# Altium project IntegratedShelfControl.PrjPCB (part 2 of 2)

## Sheet HighCurrentFetGND.SchDoc
size A4
Used 10 times, as channels HCFetG, HCFetG, HCFetG, HCFetG, HCFetG, HCFetG, HCFetG, HCFetG, HCFetG, HCFetG. Parts and nets are listed once, with the designators drawn on the sheet.
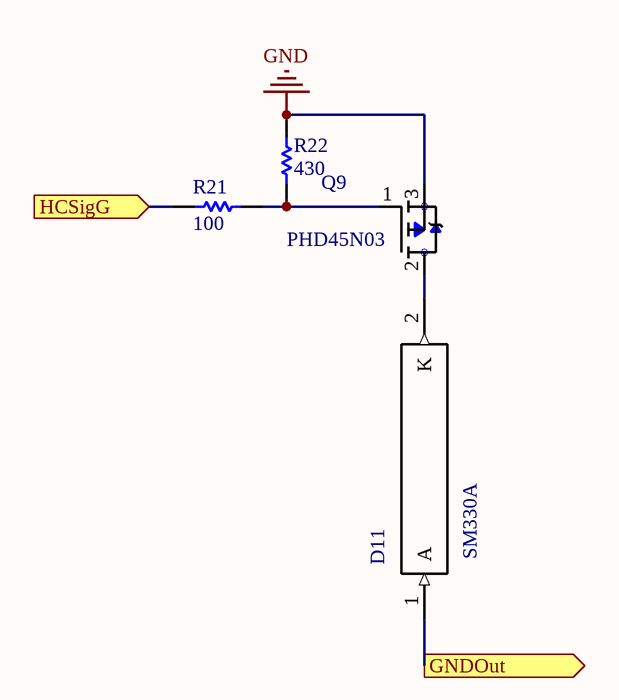
[diagram p9: HighCurrentFetGND.SchDoc]

### Parts
D11  SM330A  [*DIOM5227X270N_S1M(Primary)]
Q9  PHD45N03  [*DPAK228P998X235-3N]
R21  value 100  [6-0805_L]  (hidden comment: R100)
R22  value 430  [6-0805_L]  (hidden comment: R430)

### Ports
GNDOut (out), HCSigG (in)

### Nets
GND: Q9.3(S) R22.1
GNDOut: D11.1(A) ; port GNDOut
HCSigG: R21.1 ; port HCSigG
NetD11_2: D11.2(K) Q9.2(D)
NetQ9_1: Q9.1(G) R21.2 R22.2

### Channels
HCFetG: designators end in _HCFetG10; ports GNDOut=GNDY1 HCSigG=NetR21_HCFetG10_1
HCFetG: designators end in _HCFetG9; ports GNDOut=GNDY2 HCSigG=NetR21_HCFetG9_1
HCFetG: designators end in _HCFetG8; ports GNDOut=GNDY3 HCSigG=NetR21_HCFetG8_1
HCFetG: designators end in _HCFetG7; ports GNDOut=GNDY4 HCSigG=NetR21_HCFetG7_1
HCFetG: designators end in _HCFetG6; ports GNDOut=GNDY5 HCSigG=NetR21_HCFetG6_1
HCFetG: designators end in _HCFetG5; ports GNDOut=GNDYL1 HCSigG=NetR21_HCFetG5_1
HCFetG: designators end in _HCFetG4; ports GNDOut=GNDYL2 HCSigG=NetR21_HCFetG4_1
HCFetG: designators end in _HCFetG3; ports GNDOut=GNDYL3 HCSigG=NetR21_HCFetG3_1
HCFetG: designators end in _HCFetG2; ports GNDOut=GNDYL4 HCSigG=NetR21_HCFetG2_1
HCFetG: designators end in _HCFetG1; ports GNDOut=GNDYL5 HCSigG=NetR21_HCFetG1_1

### Notes on the sheet
- Title
- Size:
- Date:
- A4
- Number:
- Time:
- Revision:
- Sheet
- of
- File:

### Library data of the parts
D11 = STPS2L60A: SCHOTTKY RECTIFIER 2A; Voltage Vrrm: 60V; Diode Case Style: DO-214AC; Case Style: DO-214AC; pin to pad: 1>A 2>A; MF: STMicroelectronics; Price: None; Availability: Unavailable; SnapEDA_Link: https://www.snapeda.com/parts/STPS2L60A/STMicroelectronics/view-part/?ref=snap; Package: DO-214 STMicroelectronics; MP: STPS2L60A; Value: *
Q9 = IPD50P04P4L-11: P-Channel 40 V 10.6 mOhm OptiMOSآ®-P2 Power-Transistor -PG-TO-252-3; MF: Infineon Technologies; MP: IPD50P04P4L-11; Package: TO-252-3 Infineon; Price: None; Availability: Unavailable; SnapEDA_Link: https://www.snapeda.com/parts/IPD50P04P4L-11/Infineon%20Technologies/view-part/?ref=snap; Value: *
R21 R22 = Res1: Resistor; Published: 8-Jun-2000; LatestRevisionDate: 17-Jul-2002; LatestRevisionNote: Re-released for DXP Platform.; PackageReference: AXIAL-0.3; Publisher: Altium Limited; PackageDescription: Axial Device, Thru-Hole; 2 Leads; 0.3 in Pin Spacing

## Sheet SensorIn.SchDoc
size A4
Used 10 times, as channels SenIn, SenIn, SenIn, SenIn, SenIn, SenIn, SenIn, SenIn, SenIn, SenIn. Parts and nets are listed once, with the designators drawn on the sheet.
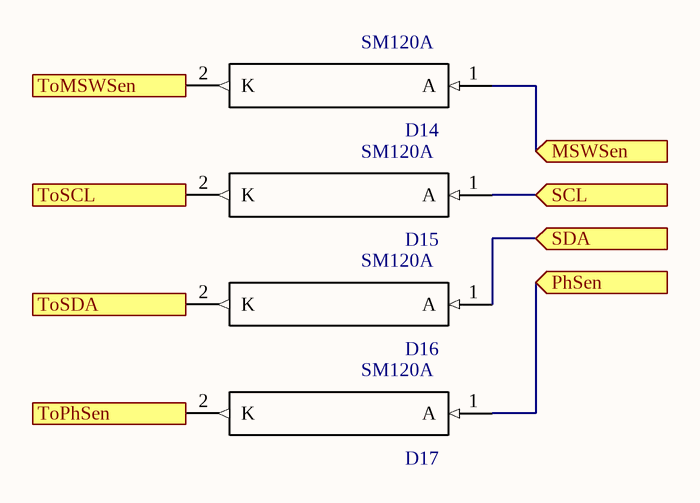
[diagram p10: SensorIn.SchDoc]

### Parts
D14  SM120A  [*DIOM5227X270N_S1M(Primary)]
D15  SM120A  [*DIOM5227X270N_S1M(Primary)]
D16  SM120A  [*DIOM5227X270N_S1M(Primary)]
D17  SM120A  [*DIOM5227X270N_S1M(Primary)]

### Ports
MSWSen (in), PhSen (in), SCL (in), SDA (in), ToMSWSen (out), ToPhSen (out), ToSCL (out), ToSDA (out)

### Nets
MSWSen: D14.1(A) ; port MSWSen
PhSen: D17.1(A) ; port PhSen
SCL: D15.1(A) ; port SCL
SDA: D16.1(A) ; port SDA
ToMSWSen: D14.2(K) ; port ToMSWSen
ToPhSen: D17.2(K) ; port ToPhSen
ToSCL: D15.2(K) ; port ToSCL
ToSDA: D16.2(K) ; port ToSDA

### Channels
SenIn: designators end in _SenIn10; ports MSWSen=MSWSen1 PhSen=PhSen1 SCL=SCL1 SDA=SDA1 ToMSWSen=MSWSen ToPhSen=PhSen ToSCL=SCL ToSDA=SDA
SenIn: designators end in _SenIn9; ports MSWSen=MSWSen2 PhSen=PhSen2 SCL=SCL2 SDA=SDA2 ToMSWSen=MSWSen ToPhSen=PhSen ToSCL=SCL ToSDA=SDA
SenIn: designators end in _SenIn8; ports MSWSen=MSWSen3 PhSen=PhSen3 SCL=SCL3 SDA=SDA3 ToMSWSen=MSWSen ToPhSen=PhSen ToSCL=SCL ToSDA=SDA
SenIn: designators end in _SenIn7; ports MSWSen=MSWSen4 PhSen=PhSen4 SCL=SCL4 SDA=SDA4 ToMSWSen=MSWSen ToPhSen=PhSen ToSCL=SCL ToSDA=SDA
SenIn: designators end in _SenIn6; ports MSWSen=MSWSen5 PhSen=PhSen5 SCL=SCL5 SDA=SDA5 ToMSWSen=MSWSen ToPhSen=PhSen ToSCL=SCL ToSDA=SDA
SenIn: designators end in _SenIn5; ports MSWSen=MSWSen6 PhSen=PhSen6 SCL=SCL6 SDA=SDA6 ToMSWSen=MSWSen ToPhSen=PhSen ToSCL=SCL ToSDA=SDA
SenIn: designators end in _SenIn4; ports MSWSen=MSWSen7 PhSen=PhSen7 SCL=SCL7 SDA=SDA7 ToMSWSen=MSWSen ToPhSen=PhSen ToSCL=SCL ToSDA=SDA
SenIn: designators end in _SenIn3; ports MSWSen=MSWSen8 PhSen=PhSen8 SCL=SCL8 SDA=SDA8 ToMSWSen=MSWSen ToPhSen=PhSen ToSCL=SCL ToSDA=SDA
SenIn: designators end in _SenIn2; ports MSWSen=MSWSen9 PhSen=PhSen9 SCL=SCL9 SDA=SDA9 ToMSWSen=MSWSen ToPhSen=PhSen ToSCL=SCL ToSDA=SDA
SenIn: designators end in _SenIn1; ports MSWSen=MSWSen10 PhSen=PhSen10 SCL=SCL10 SDA=SDA10 ToMSWSen=MSWSen ToPhSen=PhSen ToSCL=SCL ToSDA=SDA

### Notes on the sheet
- Title
- Size:
- Date:
- A4
- Number:
- Time:
- Revision:
- Sheet
- of
- File:

### Library data of the parts
D14-D17 = STPS2L60A: SCHOTTKY RECTIFIER 2A; Voltage Vrrm: 60V; Diode Case Style: DO-214AC; Case Style: DO-214AC; pin to pad: 1>A 2>A; MF: STMicroelectronics; Price: None; Availability: Unavailable; SnapEDA_Link: https://www.snapeda.com/parts/STPS2L60A/STMicroelectronics/view-part/?ref=snap; Package: DO-214 STMicroelectronics; MP: STPS2L60A; Value: *

## Nets that join several sheets
5V: ISC (5VSupply.2 P11.2 P12.2), Ch1 (6 pins), 3_3Reg (C4.1 LM2.1), 2Reg (C1.1 LM1.1), MotCtrl (SR_MotCtrl.10 SR_MotCtrl.16), ShelfSR (SR_ShelfSR5.10 SR_ShelfSR5.16), ShelfSR (SR_ShelfSR4.10 SR_ShelfSR4.16), ShelfSR (SR_ShelfSR3.10 SR_ShelfSR3.16), ShelfSR (SR_ShelfSR2.10 SR_ShelfSR2.16), ShelfSR (SR_ShelfSR1.10 SR_ShelfSR1.16), Ch2 (6 pins), Ch3 (6 pins), Ch4 (6 pins), Ch5 (6 pins), Ch6 (6 pins), Ch7 (6 pins), Ch8 (6 pins), Ch9 (6 pins), Ch10 (6 pins)
12V: ISC (12VSupply.2), Ch1 (optSupAnd_Ch1.1 optSupIP_Ch1.1 optSupTC_Ch1.1 optSupUSB_Ch1.1), HCFetV (Q10_HCFetV10.3), HCFetV (Q10_HCFetV9.3), HCFetV (Q10_HCFetV5.3), HCFetV (Q10_HCFetV4.3), Ch2 (optSupAnd_Ch2.1 optSupIP_Ch2.1 optSupTC_Ch2.1 optSupUSB_Ch2.1), Ch3 (optSupAnd_Ch3.1 optSupIP_Ch3.1 optSupTC_Ch3.1 optSupUSB_Ch3.1), Ch4 (optSupAnd_Ch4.1 optSupIP_Ch4.1 optSupTC_Ch4.1 optSupUSB_Ch4.1), Ch5 (optSupAnd_Ch5.1 optSupIP_Ch5.1 optSupTC_Ch5.1 optSupUSB_Ch5.1), Ch6 (optSupAnd_Ch6.1 optSupIP_Ch6.1 optSupTC_Ch6.1 optSupUSB_Ch6.1), Ch7 (optSupAnd_Ch7.1 optSupIP_Ch7.1 optSupTC_Ch7.1 optSupUSB_Ch7.1), Ch8 (optSupAnd_Ch8.1 optSupIP_Ch8.1 optSupTC_Ch8.1 optSupUSB_Ch8.1), Ch9 (optSupAnd_Ch9.1 optSupIP_Ch9.1 optSupTC_Ch9.1 optSupUSB_Ch9.1), Ch10 (optSupAnd_Ch10.1 optSupIP_Ch10.1 optSupTC_Ch10.1 optSupUSB_Ch10.1)
GND: ISC (6 pins), Ch1 (18 pins), MotFet (R26_MotFet7.1), 3_3Reg (6 pins), 2Reg (6 pins), HCFetV (R24_HCFetV10.1), MotFet (R26_MotFet6.1), MotFet (R26_MotFet5.1), MotFet (R26_MotFet4.1), MotFet (R26_MotFet3.1), MotFet (R26_MotFet2.1), MotFet (R26_MotFet1.1), MotCtrl (SR_MotCtrl.8 SR_MotCtrl.13), ShelfSR (SR_ShelfSR5.8 SR_ShelfSR5.13), ShelfSR (SR_ShelfSR4.8 SR_ShelfSR4.13), ShelfSR (SR_ShelfSR3.8 SR_ShelfSR3.13), ShelfSR (SR_ShelfSR2.8 SR_ShelfSR2.13), ShelfSR (SR_ShelfSR1.8 SR_ShelfSR1.13), SensorLED (R28_SensorLED14.2), HCFetV (R24_HCFetV9.1), HCFetV (R24_HCFetV8.1), HCFetV (R24_HCFetV7.1), HCFetV (R24_HCFetV6.1), HCFetG (Q9_HCFetG10.3 R22_HCFetG10.1), HCFetG (Q9_HCFetG9.3 R22_HCFetG9.1), HCFetG (Q9_HCFetG8.3 R22_HCFetG8.1), HCFetG (Q9_HCFetG7.3 R22_HCFetG7.1), SensorLED (R28_SensorLED13.2), SensorLED (R28_SensorLED12.2), SensorLED (R28_SensorLED11.2), SensorLED (R28_SensorLED10.2), SensorLED (R28_SensorLED9.2), SensorLED (R28_SensorLED8.2), HCFetG (Q9_HCFetG6.3 R22_HCFetG6.1), HCFetG (Q9_HCFetG5.3 R22_HCFetG5.1), HCFetG (Q9_HCFetG4.3 R22_HCFetG4.1), HCFetG (Q9_HCFetG3.3 R22_HCFetG3.1), HCFetG (Q9_HCFetG2.3 R22_HCFetG2.1), HCFetG (Q9_HCFetG1.3 R22_HCFetG1.1), HCFetV (R24_HCFetV5.1), SensorLED (R28_SensorLED7.2), SensorLED (R28_SensorLED6.2), SensorLED (R28_SensorLED5.2), SensorLED (R28_SensorLED4.2), SensorLED (R28_SensorLED3.2), SensorLED (R28_SensorLED2.2), SensorLED (R28_SensorLED1.2), HCFetV (R24_HCFetV4.1), HCFetV (R24_HCFetV3.1), HCFetV (R24_HCFetV2.1), HCFetV (R24_HCFetV1.1), Ch2 (18 pins), Ch3 (18 pins), Ch4 (18 pins), Ch5 (18 pins), Ch6 (18 pins), Ch7 (18 pins), Ch8 (18 pins), Ch9 (18 pins), Ch10 (18 pins)
2V: 2Reg (C2.2 C3.2 L1.2 R18.1), SensorLED (Q12_SensorLED14.2), HCFetV (Q10_HCFetV8.3), HCFetV (Q10_HCFetV7.3), HCFetV (Q10_HCFetV6.3), SensorLED (Q12_SensorLED12.2), SensorLED (Q12_SensorLED11.2), SensorLED (Q12_SensorLED10.2), SensorLED (Q12_SensorLED9.2), SensorLED (Q12_SensorLED8.2), SensorLED (Q12_SensorLED7.2), SensorLED (Q12_SensorLED5.2), SensorLED (Q12_SensorLED4.2), SensorLED (Q12_SensorLED3.2), SensorLED (Q12_SensorLED2.2), SensorLED (Q12_SensorLED1.2), HCFetV (Q10_HCFetV3.3), HCFetV (Q10_HCFetV2.3), HCFetV (Q10_HCFetV1.3)
3.3V: 3_3Reg (C5.2 C6.2 L2.2 R20.1), SensorLED (Q12_SensorLED13.2), SensorLED (Q12_SensorLED6.2)
Data+And1: ISC (P1.33), Ch1 (ChAnd_Ch1.3)
Data+And2: ISC (P2.33), Ch2 (ChAnd_Ch2.3)
Data+And3: ISC (P3.33), Ch3 (ChAnd_Ch3.3)
Data+And4: ISC (P4.33), Ch4 (ChAnd_Ch4.3)
Data+And5: ISC (P5.33), Ch5 (ChAnd_Ch5.3)
Data+And6: ISC (P6.33), Ch6 (ChAnd_Ch6.3)
Data+And7: ISC (P7.33), Ch7 (ChAnd_Ch7.3)
Data+And8: ISC (P8.33), Ch8 (ChAnd_Ch8.3)
Data+And9: ISC (P9.33), Ch9 (ChAnd_Ch9.3)
Data+And10: ISC (P10.33), Ch10 (ChAnd_Ch10.3)
Data+IP1: ISC (P1.35), Ch1 (ChIP_Ch1.3)
Data+IP2: ISC (P2.35), Ch2 (ChIP_Ch2.3)
Data+IP3: ISC (P3.35), Ch3 (ChIP_Ch3.3)
Data+IP4: ISC (P4.35), Ch4 (ChIP_Ch4.3)
Data+IP5: ISC (P5.35), Ch5 (ChIP_Ch5.3)
Data+IP6: ISC (P6.35), Ch6 (ChIP_Ch6.3)
Data+IP7: ISC (P7.35), Ch7 (ChIP_Ch7.3)
Data+IP8: ISC (P8.35), Ch8 (ChIP_Ch8.3)
Data+IP9: ISC (P9.35), Ch9 (ChIP_Ch9.3)
Data+IP10: ISC (P10.35), Ch10 (ChIP_Ch10.3)
Data+TC1: ISC (P1.37), Ch1 (ChTC_Ch1.3)
Data+TC2: ISC (P2.37), Ch2 (ChTC_Ch2.3)
Data+TC3: ISC (P3.37), Ch3 (ChTC_Ch3.3)
Data+TC4: ISC (P4.37), Ch4 (ChTC_Ch4.3)
Data+TC5: ISC (P5.37), Ch5 (ChTC_Ch5.3)
Data+TC6: ISC (P6.37), Ch6 (ChTC_Ch6.3)
Data+TC7: ISC (P7.37), Ch7 (ChTC_Ch7.3)
Data+TC8: ISC (P8.37), Ch8 (ChTC_Ch8.3)
Data+TC9: ISC (P9.37), Ch9 (ChTC_Ch9.3)
Data+TC10: ISC (P10.37), Ch10 (ChTC_Ch10.3)
Data+USB1: ISC (P1.39), Ch1 (ChUSB_Ch1.3)
Data+USB2: ISC (P2.39), Ch2 (ChUSB_Ch2.3)
Data+USB3: ISC (P3.39), Ch3 (ChUSB_Ch3.3)
Data+USB4: ISC (P4.39), Ch4 (ChUSB_Ch4.3)
Data+USB5: ISC (P5.39), Ch5 (ChUSB_Ch5.3)
Data+USB6: ISC (P6.39), Ch6 (ChUSB_Ch6.3)
Data+USB7: ISC (P7.39), Ch7 (ChUSB_Ch7.3)
Data+USB8: ISC (P8.39), Ch8 (ChUSB_Ch8.3)
Data+USB9: ISC (P9.39), Ch9 (ChUSB_Ch9.3)
Data+USB10: ISC (P10.39), Ch10 (ChUSB_Ch10.3)
Data-And1: ISC (P1.34), Ch1 (ChAnd_Ch1.2)
Data-And2: ISC (P2.34), Ch2 (ChAnd_Ch2.2)
Data-And3: ISC (P3.34), Ch3 (ChAnd_Ch3.2)
Data-And4: ISC (P4.34), Ch4 (ChAnd_Ch4.2)
Data-And5: ISC (P5.34), Ch5 (ChAnd_Ch5.2)
Data-And6: ISC (P6.34), Ch6 (ChAnd_Ch6.2)
Data-And7: ISC (P7.34), Ch7 (ChAnd_Ch7.2)
Data-And8: ISC (P8.34), Ch8 (ChAnd_Ch8.2)
Data-And9: ISC (P9.34), Ch9 (ChAnd_Ch9.2)
Data-And10: ISC (P10.34), Ch10 (ChAnd_Ch10.2)
Data-IP1: ISC (P1.36), Ch1 (ChIP_Ch1.2)
Data-IP2: ISC (P2.36), Ch2 (ChIP_Ch2.2)
Data-IP3: ISC (P3.36), Ch3 (ChIP_Ch3.2)
Data-IP4: ISC (P4.36), Ch4 (ChIP_Ch4.2)
Data-IP5: ISC (P5.36), Ch5 (ChIP_Ch5.2)
Data-IP6: ISC (P6.36), Ch6 (ChIP_Ch6.2)
Data-IP7: ISC (P7.36), Ch7 (ChIP_Ch7.2)
Data-IP8: ISC (P8.36), Ch8 (ChIP_Ch8.2)
Data-IP9: ISC (P9.36), Ch9 (ChIP_Ch9.2)
Data-IP10: ISC (P10.36), Ch10 (ChIP_Ch10.2)
Data-TC1: ISC (P1.38), Ch1 (ChTC_Ch1.2)
Data-TC2: ISC (P2.38), Ch2 (ChTC_Ch2.2)
Data-TC3: ISC (P3.38), Ch3 (ChTC_Ch3.2)
Data-TC4: ISC (P4.38), Ch4 (ChTC_Ch4.2)
Data-TC5: ISC (P5.38), Ch5 (ChTC_Ch5.2)
Data-TC6: ISC (P6.38), Ch6 (ChTC_Ch6.2)
Data-TC7: ISC (P7.38), Ch7 (ChTC_Ch7.2)
Data-TC8: ISC (P8.38), Ch8 (ChTC_Ch8.2)
Data-TC9: ISC (P9.38), Ch9 (ChTC_Ch9.2)
Data-TC10: ISC (P10.38), Ch10 (ChTC_Ch10.2)
Data-USB1: ISC (P1.40), Ch1 (ChUSB_Ch1.2)
Data-USB2: ISC (P2.40), Ch2 (ChUSB_Ch2.2)
Data-USB3: ISC (P3.40), Ch3 (ChUSB_Ch3.2)
Data-USB4: ISC (P4.40), Ch4 (ChUSB_Ch4.2)
Data-USB5: ISC (P5.40), Ch5 (ChUSB_Ch5.2)
Data-USB6: ISC (P6.40), Ch6 (ChUSB_Ch6.2)
Data-USB7: ISC (P7.40), Ch7 (ChUSB_Ch7.2)
Data-USB8: ISC (P8.40), Ch8 (ChUSB_Ch8.2)
Data-USB9: ISC (P9.40), Ch9 (ChUSB_Ch9.2)
Data-USB10: ISC (P10.40), Ch10 (ChUSB_Ch10.2)
DriverPin1: ISC (P13.2), MotFet (Q11_MotFet7.3), MotFet (Q11_MotFet6.3)
DriverPin2: ISC (P13.3), MotFet (Q11_MotFet5.3), MotFet (Q11_MotFet4.3), MotFet (Q11_MotFet3.3), MotFet (Q11_MotFet2.3), MotFet (Q11_MotFet1.3)
DS_4: ISC (ArdPin1.4), ShelfSR (SR_ShelfSR5.14)
DS_7: ISC (ArdPin1.1), Ch1 (SR1_Ch1.14)
DSSh2: ShelfSR (SR_ShelfSR5.9), ShelfSR (SR_ShelfSR4.14)
DSSh3: ShelfSR (SR_ShelfSR4.9), ShelfSR (SR_ShelfSR3.14)
DSSh4: ShelfSR (SR_ShelfSR3.9), ShelfSR (SR_ShelfSR2.14)
DSSh5: ShelfSR (SR_ShelfSR2.9), ShelfSR (SR_ShelfSR1.14)
F1-12V: ISC (5 pins), HCFetV (D12_HCFetV9.2)
F2-12V: ISC (5 pins), HCFetV (D12_HCFetV4.2)
GNDMeasure: ISC (ACSout1.1), Ch1 (Q3_Ch1.3 Q4_Ch1.3 Q7_Ch1.3 Q8_Ch1.3), Ch2 (Q3_Ch2.3 Q4_Ch2.3 Q7_Ch2.3 Q8_Ch2.3), Ch3 (Q3_Ch3.3 Q4_Ch3.3 Q7_Ch3.3 Q8_Ch3.3), Ch4 (Q3_Ch4.3 Q4_Ch4.3 Q7_Ch4.3 Q8_Ch4.3), Ch5 (Q3_Ch5.3 Q4_Ch5.3 Q7_Ch5.3 Q8_Ch5.3), Ch6 (Q3_Ch6.3 Q4_Ch6.3 Q7_Ch6.3 Q8_Ch6.3), Ch7 (Q3_Ch7.3 Q4_Ch7.3 Q7_Ch7.3 Q8_Ch7.3), Ch8 (Q3_Ch8.3 Q4_Ch8.3 Q7_Ch8.3 Q8_Ch8.3), Ch9 (Q3_Ch9.3 Q4_Ch9.3 Q7_Ch9.3 Q8_Ch9.3), Ch10 (Q3_Ch10.3 Q4_Ch10.3 Q7_Ch10.3 Q8_Ch10.3)
GNDY1: ISC (16 pins), Ch1 (PHC_Ch1.11), HCFetG (D11_HCFetG10.1), Ch6 (PHC_Ch6.11)
GNDY2: ISC (16 pins), HCFetG (D11_HCFetG9.1), Ch2 (PHC_Ch2.11), Ch7 (PHC_Ch7.11)
GNDY3: ISC (16 pins), HCFetG (D11_HCFetG8.1), Ch3 (PHC_Ch3.11), Ch8 (PHC_Ch8.11)
GNDY4: ISC (16 pins), HCFetG (D11_HCFetG7.1), Ch4 (PHC_Ch4.11), Ch9 (PHC_Ch9.11)
GNDY5: ISC (16 pins), HCFetG (D11_HCFetG6.1), Ch5 (PHC_Ch5.11), Ch10 (PHC_Ch10.11)
GNDYL1: ISC (8 pins), HCFetG (D11_HCFetG5.1)
GNDYL2: ISC (8 pins), HCFetG (D11_HCFetG4.1)
GNDYL3: ISC (8 pins), HCFetG (D11_HCFetG3.1)
GNDYL4: ISC (8 pins), HCFetG (D11_HCFetG2.1)
GNDYL5: ISC (8 pins), HCFetG (D11_HCFetG1.1)
LAnd1-2V: ISC (5 pins), SensorLED (Q12_SensorLED14.3)
LAnd2-2V: ISC (5 pins), SensorLED (Q12_SensorLED7.3)
LDC1-2V: ISC (5 pins), SensorLED (Q12_SensorLED8.3)
LDC2-2V: ISC (5 pins), SensorLED (Q12_SensorLED1.3)
LG1-2V: ISC (5 pins), HCFetV (D12_HCFetV8.2)
LG2-2V: ISC (5 pins), HCFetV (D12_HCFetV3.2)
LIP1-2V: ISC (5 pins), SensorLED (Q12_SensorLED11.3)
LIP2-2V: ISC (5 pins), SensorLED (Q12_SensorLED4.3)
Lock1-12V: Ch1 (PHC_Ch1.12), HCFetV (D12_HCFetV10.2), Ch2 (PHC_Ch2.12), Ch3 (PHC_Ch3.12), Ch4 (PHC_Ch4.12), Ch5 (PHC_Ch5.12)
Lock2-12V: HCFetV (D12_HCFetV5.2), Ch6 (PHC_Ch6.12), Ch7 (PHC_Ch7.12), Ch8 (PHC_Ch8.12), Ch9 (PHC_Ch9.12), Ch10 (PHC_Ch10.12)
LR1-2V: ISC (5 pins), HCFetV (D12_HCFetV6.2)
LR2-2V: ISC (5 pins), HCFetV (D12_HCFetV1.2)
LSen1-2V: ISC (5 pins), SensorLED (Q12_SensorLED12.3)
LSen2-2V: ISC (5 pins), SensorLED (Q12_SensorLED5.3)
LTC1-2V: ISC (5 pins), SensorLED (Q12_SensorLED10.3)
LTC2-2V: ISC (5 pins), SensorLED (Q12_SensorLED3.3)
LUSB1-2V: ISC (5 pins), SensorLED (Q12_SensorLED9.3)
LUSB2-2V: ISC (5 pins), SensorLED (Q12_SensorLED2.3)
LY1-2V: ISC (5 pins), HCFetV (D12_HCFetV7.2)
LY2-2V: ISC (5 pins), HCFetV (D12_HCFetV2.2)
MoX1: Ch1 (PHC_Ch1.9), MotFet (Q11_MotFet7.2), Ch2 (PHC_Ch2.9), Ch3 (PHC_Ch3.9), Ch4 (PHC_Ch4.9), Ch5 (PHC_Ch5.9)
MoX1Sig: MotFet (R25_MotFet7.1), MotCtrl (SR_MotCtrl.15)
MoX2: MotFet (Q11_MotFet6.2), Ch6 (PHC_Ch6.9), Ch7 (PHC_Ch7.9), Ch8 (PHC_Ch8.9), Ch9 (PHC_Ch9.9), Ch10 (PHC_Ch10.9)
MoX2Sig: MotFet (R25_MotFet6.1), MotCtrl (SR_MotCtrl.6)
MoY1: Ch1 (PHC_Ch1.10), MotFet (Q11_MotFet1.2), Ch6 (PHC_Ch6.10)
MoY1Sig: MotFet (R25_MotFet1.1), MotCtrl (SR_MotCtrl.1)
MoY2: MotFet (Q11_MotFet2.2), Ch2 (PHC_Ch2.10), Ch7 (PHC_Ch7.10)
MoY2Sig: MotFet (R25_MotFet2.1), MotCtrl (SR_MotCtrl.4)
MoY3: MotFet (Q11_MotFet3.2), Ch3 (PHC_Ch3.10), Ch8 (PHC_Ch8.10)
MoY3Sig: MotFet (R25_MotFet3.1), MotCtrl (SR_MotCtrl.3)
MoY4: MotFet (Q11_MotFet4.2), Ch4 (PHC_Ch4.10), Ch9 (PHC_Ch9.10)
MoY4Sig: MotFet (R25_MotFet4.1), MotCtrl (SR_MotCtrl.5)
MoY5: MotFet (Q11_MotFet5.2), Ch5 (PHC_Ch5.10), Ch10 (PHC_Ch10.10)
MoY5Sig: MotFet (R25_MotFet5.1), MotCtrl (SR_MotCtrl.2)
MSWSen: ISC (ArdPin1.7), SenIn (D14_SenIn10.2), SenIn (D14_SenIn9.2), SenIn (D14_SenIn8.2), SenIn (D14_SenIn7.2), SenIn (D14_SenIn6.2), SenIn (D14_SenIn5.2), SenIn (D14_SenIn4.2), SenIn (D14_SenIn3.2), SenIn (D14_SenIn2.2), SenIn (D14_SenIn1.2)
MSWSen1: ISC (P1.7), SenIn (D14_SenIn10.1)
MSWSen2: ISC (P2.7), SenIn (D14_SenIn9.1)
MSWSen3: ISC (P3.7), SenIn (D14_SenIn8.1)
MSWSen4: ISC (P4.7), SenIn (D14_SenIn7.1)
MSWSen5: ISC (P5.7), SenIn (D14_SenIn6.1)
MSWSen6: ISC (P6.7), SenIn (D14_SenIn5.1)
MSWSen7: ISC (P7.7), SenIn (D14_SenIn4.1)
MSWSen8: ISC (P8.7), SenIn (D14_SenIn3.1)
MSWSen9: ISC (P9.7), SenIn (D14_SenIn2.1)
MSWSen10: ISC (P10.7), SenIn (D14_SenIn1.1)
NetR21_HCFetG1_1: ShelfSR (SR_ShelfSR3.5), HCFetG (R21_HCFetG1.1)
NetR21_HCFetG2_1: ShelfSR (SR_ShelfSR3.3), HCFetG (R21_HCFetG2.1)
NetR21_HCFetG3_1: ShelfSR (SR_ShelfSR3.4), HCFetG (R21_HCFetG3.1)
NetR21_HCFetG4_1: ShelfSR (SR_ShelfSR3.1), HCFetG (R21_HCFetG4.1)
NetR21_HCFetG5_1: ShelfSR (SR_ShelfSR3.6), HCFetG (R21_HCFetG5.1)
NetR21_HCFetG6_1: ShelfSR (SR_ShelfSR3.15), HCFetG (R21_HCFetG6.1)
NetR21_HCFetG7_1: ShelfSR (SR_ShelfSR4.7), HCFetG (R21_HCFetG7.1)
NetR21_HCFetG8_1: ShelfSR (SR_ShelfSR4.2), HCFetG (R21_HCFetG8.1)
NetR21_HCFetG9_1: ShelfSR (SR_ShelfSR4.5), HCFetG (R21_HCFetG9.1)
NetR21_HCFetG10_1: ShelfSR (SR_ShelfSR4.3), HCFetG (R21_HCFetG10.1)
NetR23_HCFetV1_1: ShelfSR (SR_ShelfSR1.4), HCFetV (R23_HCFetV1.1)
NetR23_HCFetV2_1: ShelfSR (SR_ShelfSR1.1), HCFetV (R23_HCFetV2.1)
NetR23_HCFetV3_1: ShelfSR (SR_ShelfSR1.6), HCFetV (R23_HCFetV3.1)
NetR23_HCFetV4_1: ShelfSR (SR_ShelfSR1.15), HCFetV (R23_HCFetV4.1)
NetR23_HCFetV5_1: ShelfSR (SR_ShelfSR2.7), HCFetV (R23_HCFetV5.1)
NetR23_HCFetV6_1: ShelfSR (SR_ShelfSR4.4), HCFetV (R23_HCFetV6.1)
NetR23_HCFetV7_1: ShelfSR (SR_ShelfSR4.1), HCFetV (R23_HCFetV7.1)
NetR23_HCFetV8_1: ShelfSR (SR_ShelfSR4.6), HCFetV (R23_HCFetV8.1)
NetR23_HCFetV9_1: ShelfSR (SR_ShelfSR4.15), HCFetV (R23_HCFetV9.1)
NetR23_HCFetV10_1: HCFetV (R23_HCFetV10.1), ShelfSR (SR_ShelfSR5.7)
NetR27_SensorLED1_2: ShelfSR (SR_ShelfSR2.2), SensorLED (R27_SensorLED1.2)
NetR27_SensorLED2_2: ShelfSR (SR_ShelfSR2.5), SensorLED (R27_SensorLED2.2)
NetR27_SensorLED3_2: ShelfSR (SR_ShelfSR2.3), SensorLED (R27_SensorLED3.2)
NetR27_SensorLED4_2: ShelfSR (SR_ShelfSR2.4), SensorLED (R27_SensorLED4.2)
NetR27_SensorLED5_2: ShelfSR (SR_ShelfSR2.6), SensorLED (R27_SensorLED5.2)
NetR27_SensorLED6_2: ShelfSR (SR_ShelfSR2.15), SensorLED (R27_SensorLED6.2)
NetR27_SensorLED7_2: ShelfSR (SR_ShelfSR2.1), SensorLED (R27_SensorLED7.2)
NetR27_SensorLED8_2: ShelfSR (SR_ShelfSR5.2), SensorLED (R27_SensorLED8.2)
NetR27_SensorLED9_2: ShelfSR (SR_ShelfSR5.5), SensorLED (R27_SensorLED9.2)
NetR27_SensorLED10_2: ShelfSR (SR_ShelfSR5.3), SensorLED (R27_SensorLED10.2)
NetR27_SensorLED11_2: ShelfSR (SR_ShelfSR5.4), SensorLED (R27_SensorLED11.2)
NetR27_SensorLED12_2: ShelfSR (SR_ShelfSR5.6), SensorLED (R27_SensorLED12.2)
NetR27_SensorLED13_2: ShelfSR (SR_ShelfSR5.15), SensorLED (R27_SensorLED13.2)
NetR27_SensorLED14_2: ShelfSR (SR_ShelfSR5.1), SensorLED (R27_SensorLED14.2)
NetSR1_Ch1_9: Ch1 (SR1_Ch1.9), Ch2 (SR1_Ch2.14)
NetSR1_Ch2_9: Ch2 (SR1_Ch2.9), Ch3 (SR1_Ch3.14)
NetSR1_Ch3_9: Ch3 (SR1_Ch3.9), Ch4 (SR1_Ch4.14)
NetSR1_Ch4_9: Ch4 (SR1_Ch4.9), Ch5 (SR1_Ch5.14)
NetSR1_Ch5_9: Ch5 (SR1_Ch5.9), Ch6 (SR1_Ch6.14)
NetSR1_Ch6_9: Ch6 (SR1_Ch6.9), Ch7 (SR1_Ch7.14)
NetSR1_Ch7_9: Ch7 (SR1_Ch7.9), Ch8 (SR1_Ch8.14)
NetSR1_Ch8_9: Ch8 (SR1_Ch8.9), Ch9 (SR1_Ch9.14)
NetSR1_Ch9_9: Ch9 (SR1_Ch9.9), Ch10 (SR1_Ch10.14)
NetSR1_Ch10_9: MotCtrl (SR_MotCtrl.14), Ch10 (SR1_Ch10.9)
PhSen: ISC (ArdPin1.8), SenIn (D17_SenIn10.2), SenIn (D17_SenIn9.2), SenIn (D17_SenIn8.2), SenIn (D17_SenIn7.2), SenIn (D17_SenIn6.2), SenIn (D17_SenIn5.2), SenIn (D17_SenIn4.2), SenIn (D17_SenIn3.2), SenIn (D17_SenIn2.2), SenIn (D17_SenIn1.2)
PhSen1: ISC (P1.3), SenIn (D17_SenIn10.1)
PhSen2: ISC (P2.3), SenIn (D17_SenIn9.1)
PhSen3: ISC (P3.3), SenIn (D17_SenIn8.1)
PhSen4: ISC (P4.3), SenIn (D17_SenIn7.1)
PhSen5: ISC (P5.3), SenIn (D17_SenIn6.1)
PhSen6: ISC (P6.3), SenIn (D17_SenIn5.1)
PhSen7: ISC (P7.3), SenIn (D17_SenIn4.1)
PhSen8: ISC (P8.3), SenIn (D17_SenIn3.1)
PhSen9: ISC (P9.3), SenIn (D17_SenIn2.1)
PhSen10: ISC (P10.3), SenIn (D17_SenIn1.1)
SCL: ISC (ArdPin1.10), SenIn (D15_SenIn10.2), SenIn (D15_SenIn9.2), SenIn (D15_SenIn8.2), SenIn (D15_SenIn7.2), SenIn (D15_SenIn6.2), SenIn (D15_SenIn5.2), SenIn (D15_SenIn4.2), SenIn (D15_SenIn3.2), SenIn (D15_SenIn2.2), SenIn (D15_SenIn1.2)
SCL1: ISC (P1.11), SenIn (D15_SenIn10.1)
SCL2: ISC (P2.11), SenIn (D15_SenIn9.1)
SCL3: ISC (P3.11), SenIn (D15_SenIn8.1)
SCL4: ISC (P4.11), SenIn (D15_SenIn7.1)
SCL5: ISC (P5.11), SenIn (D15_SenIn6.1)
SCL6: ISC (P6.11), SenIn (D15_SenIn5.1)
SCL7: ISC (P7.11), SenIn (D15_SenIn4.1)
SCL8: ISC (P8.11), SenIn (D15_SenIn3.1)
SCL9: ISC (P9.11), SenIn (D15_SenIn2.1)
SCL10: ISC (P10.11), SenIn (D15_SenIn1.1)
SDA: ISC (ArdPin1.9), SenIn (D16_SenIn10.2), SenIn (D16_SenIn9.2), SenIn (D16_SenIn8.2), SenIn (D16_SenIn7.2), SenIn (D16_SenIn6.2), SenIn (D16_SenIn5.2), SenIn (D16_SenIn4.2), SenIn (D16_SenIn3.2), SenIn (D16_SenIn2.2), SenIn (D16_SenIn1.2)
SDA1: ISC (P1.10), SenIn (D16_SenIn10.1)
SDA2: ISC (P2.10), SenIn (D16_SenIn9.1)
SDA3: ISC (P3.10), SenIn (D16_SenIn8.1)
SDA4: ISC (P4.10), SenIn (D16_SenIn7.1)
SDA5: ISC (P5.10), SenIn (D16_SenIn6.1)
SDA6: ISC (P6.10), SenIn (D16_SenIn5.1)
SDA7: ISC (P7.10), SenIn (D16_SenIn4.1)
SDA8: ISC (P8.10), SenIn (D16_SenIn3.1)
SDA9: ISC (P9.10), SenIn (D16_SenIn2.1)
SDA10: ISC (P10.10), SenIn (D16_SenIn1.1)
Sen1-3.3V: ISC (15 pins), SensorLED (Q12_SensorLED13.3)
Sen2-3.3V: ISC (15 pins), SensorLED (Q12_SensorLED6.3)
SH_CP_2: ISC (ArdPin1.6), ShelfSR (SR_ShelfSR5.11), ShelfSR (SR_ShelfSR4.12), ShelfSR (SR_ShelfSR3.12), ShelfSR (SR_ShelfSR2.12), ShelfSR (SR_ShelfSR1.12)
SH_CP_5: ISC (ArdPin1.3), Ch1 (SR1_Ch1.11), MotCtrl (SR_MotCtrl.11), Ch2 (SR1_Ch2.11), Ch3 (SR1_Ch3.11), Ch4 (SR1_Ch4.11), Ch5 (SR1_Ch5.11), Ch6 (SR1_Ch6.11), Ch7 (SR1_Ch7.11), Ch8 (SR1_Ch8.11), Ch9 (SR1_Ch9.11), Ch10 (SR1_Ch10.11)
ST_CP_3: ISC (ArdPin1.5), ShelfSR (SR_ShelfSR5.12), ShelfSR (SR_ShelfSR4.11), ShelfSR (SR_ShelfSR3.11), ShelfSR (SR_ShelfSR2.11), ShelfSR (SR_ShelfSR1.11)
ST_CP_6: ISC (ArdPin1.2), Ch1 (SR1_Ch1.12), MotCtrl (SR_MotCtrl.12), Ch2 (SR1_Ch2.12), Ch3 (SR1_Ch3.12), Ch4 (SR1_Ch4.12), Ch5 (SR1_Ch5.12), Ch6 (SR1_Ch6.12), Ch7 (SR1_Ch7.12), Ch8 (SR1_Ch8.12), Ch9 (SR1_Ch9.12), Ch10 (SR1_Ch10.12)